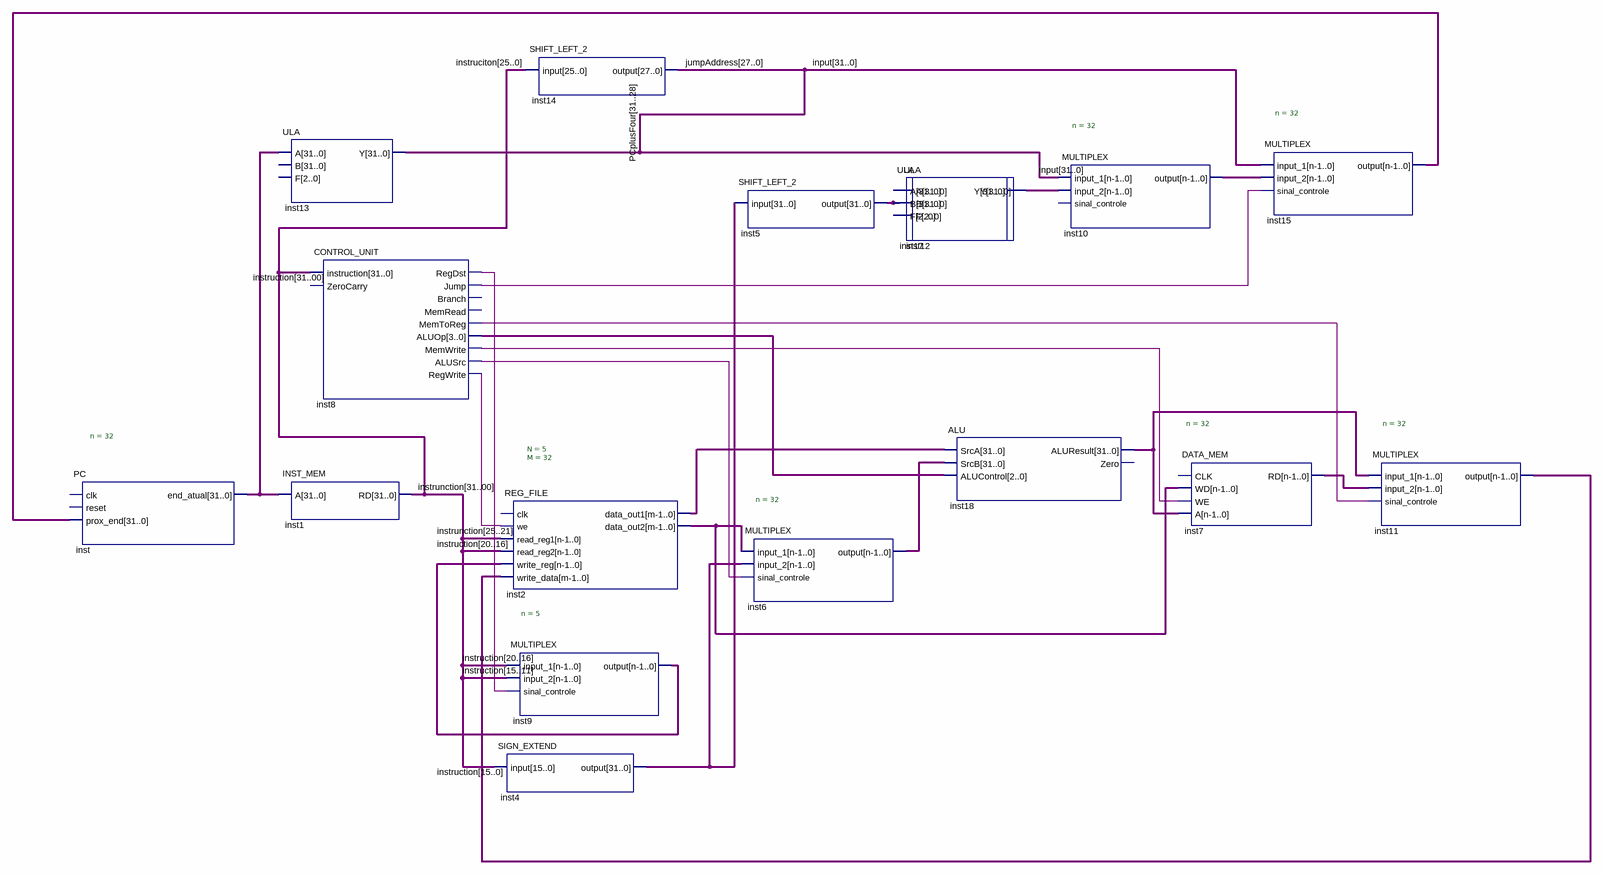
[diagram p0: schematic sheet]
// Quartus schematic PROJETO.bdf as structural Verilog: 17 symbols, 0 pins
module PROJETO (
);

  wire inst8_alusrc, inst8_jump, inst8_memtoreg, inst8_memwrite, inst8_regdst, inst8_regwrite;
  wire [3:0] inst8_aluop;
  wire [4:0] inst9_output;
  wire [25:0] instruciton;
  wire [27:0] jumpAddress;
  wire [31:0] \input , inst2_data_out1, inst2_data_out2, inst4_output, inst5_output, inst6_output, inst7_rd,
       inst10_output, inst11_output, inst12_y, inst15_output, inst18_aluresult, inst_end_atual, instruction,
       instrunction;

  PC #(.n(32)) inst (.prox_end(inst15_output), .end_atual(inst_end_atual));  // open: clk, reset
  ULA inst13 (.A(inst_end_atual), .Y(\input ));  // open: B, F
  CONTROL_UNIT inst8 (
    .instruction(instruction), .RegDst(inst8_regdst), .Jump(inst8_jump), .MemToReg(inst8_memtoreg),
    .ALUOp(inst8_aluop), .MemWrite(inst8_memwrite), .ALUSrc(inst8_alusrc), .RegWrite(inst8_regwrite));  // open: ZeroCarry, Branch, MemRead
  INST_MEM inst1 (.A(inst_end_atual), .RD(instrunction));
  REG_FILE #(.N(5), .M(32)) inst2 (
    .we(inst8_regwrite), .read_reg1(instrunction[25:21]), .read_reg2(instruction[20:16]),
    .write_reg(inst9_output), .write_data(inst11_output), .data_out1(inst2_data_out1),
    .data_out2(inst2_data_out2));  // open: clk
  MULTIPLEX #(.n(5)) inst9 (
    .input_1(instruction[20:16]), .input_2(instruction[15:11]), .sinal_controle(inst8_regdst),
    .\output (inst9_output));
  SIGN_EXTEND inst4 (.\input (instruction[15:0]), .\output (inst4_output));
  SHIFT_LEFT_2 inst14 (.\input (instruciton), .\output (jumpAddress));
  SHIFT_LEFT_2 inst5 (.\input (inst4_output), .\output (inst5_output));
  MULTIPLEX #(.n(32)) inst6 (
    .input_1(inst2_data_out2), .input_2(inst4_output), .sinal_controle(inst8_alusrc), .\output (inst6_output));
  ULA inst12 (.B(inst5_output), .Y(inst12_y));  // open: A, F
  ULA inst17 (.B(inst5_output));  // open: A, F, Y
  ALU inst18 (
    .SrcA(inst2_data_out1), .SrcB(inst6_output), .ALUControl(inst8_aluop), .ALUResult(inst18_aluresult));  // open: Zero
  MULTIPLEX #(.n(32)) inst10 (.input_1(\input ), .input_2(inst12_y), .\output (inst10_output));  // open: sinal_controle
  DATA_MEM #(.n(32)) inst7 (
    .WD(inst2_data_out2), .WE(inst8_memwrite), .A(inst18_aluresult), .RD(inst7_rd));  // open: CLK
  MULTIPLEX #(.n(32)) inst15 (
    .input_1(\input ), .input_2(inst10_output), .sinal_controle(inst8_jump), .\output (inst15_output));
  MULTIPLEX #(.n(32)) inst11 (
    .input_1(inst18_aluresult), .input_2(inst7_rd), .sinal_controle(inst8_memtoreg), .\output (inst11_output));
endmodule
